# Altium project Tx_rev_B.PrjPcb
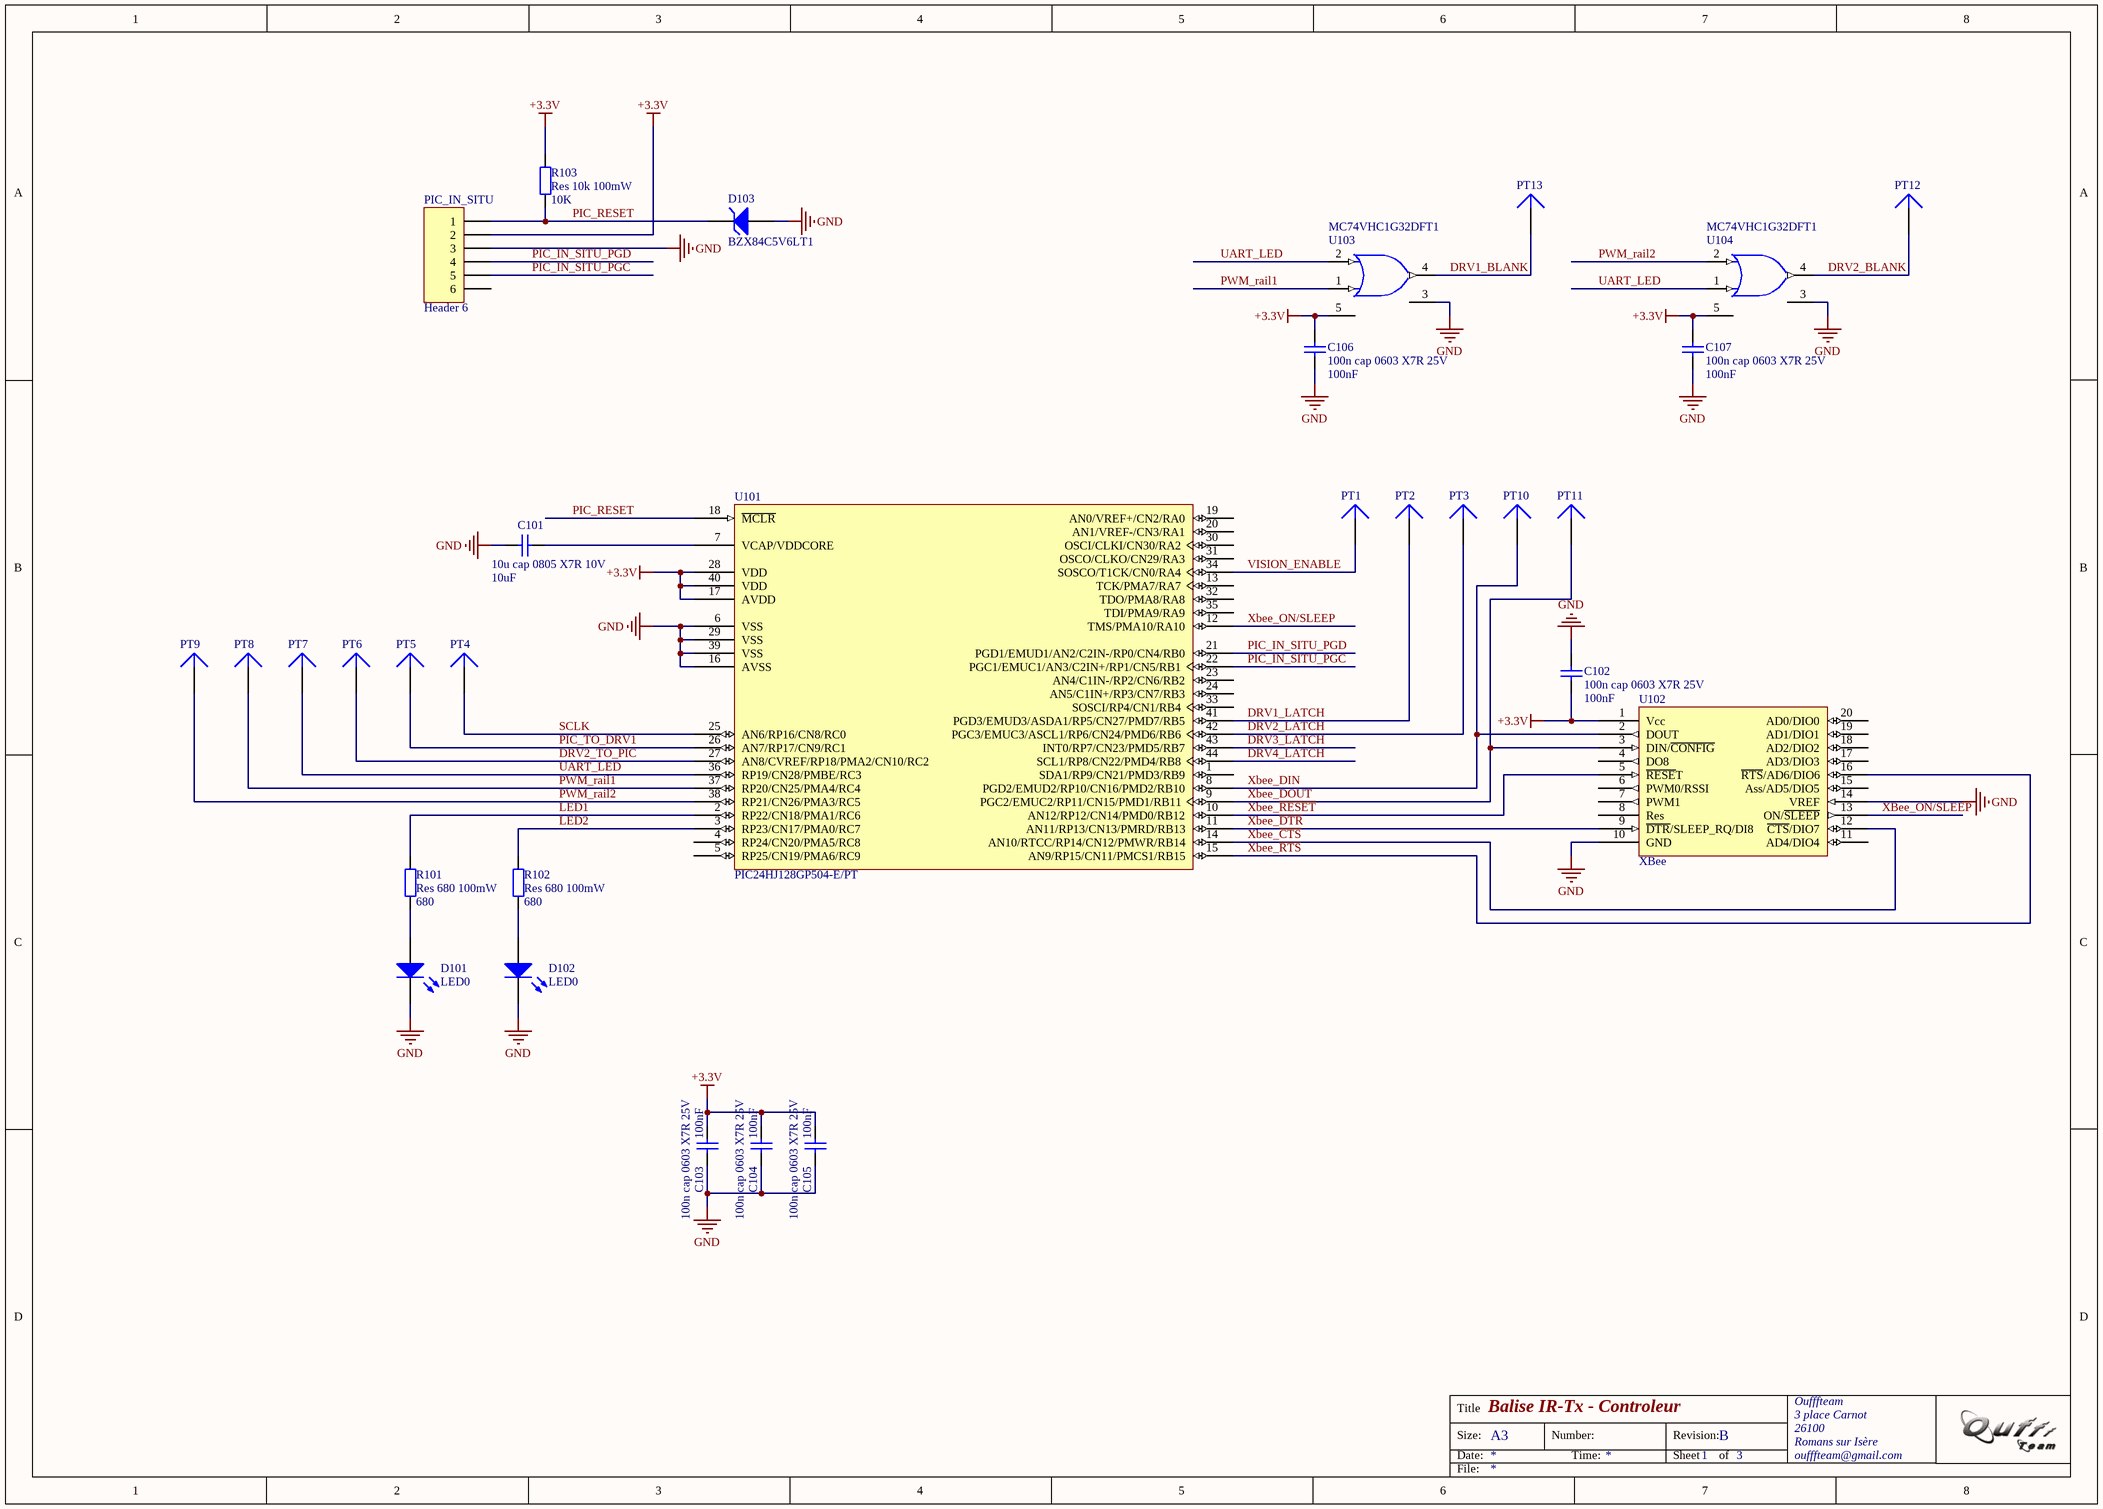
[diagram p0: Tx_micro.SchDoc]
3 sheets, 139 parts. Net scope: global (net labels, ports and power ports of the same name join across sheets).
Board file: Tx_pcb.PcbDoc
Sheets:
  Tx_micro.SchDoc
  Tx_power.SchDoc
  Tx_leds.SchDoc

## Sheet Tx_micro.SchDoc: Balise IR-Tx - Controleur
size A3; Author: B Labbe; CompanyName: Oufffteam; DrawnBy: B Labbe; Engineer: B Labbe; Organization: Oufffteam; Address1: L3, 12a Rodborough Rd; Address2: Frenchs Forest; Address3: NSW; Address4: Australia 2086; Revision: B; SheetNumber: 1; SheetTotal: 3; DocumentName: Balise IR-Tx - Controleur

### Parts
C101  10u cap 0805 X7R 10V  value 10uF  [0805]
C102  100n cap 0603 X7R 25V  value 100nF  [0603]
C103  100n cap 0603 X7R 25V  value 100nF  [0603]
C104  100n cap 0603 X7R 25V  value 100nF  [0603]
C105  100n cap 0603 X7R 25V  value 100nF  [0603]
C106  100n cap 0603 X7R 25V  value 100nF  [0603]
C107  100n cap 0603 X7R 25V  value 100nF  [0603]
D101  LED0  [0603]
D102  LED0  [0603]
D103  BZX84C5V6LT1  [318-07]
PIC_IN_SITU  Header 6  [HDR1X6]
PT1  Plug  [TP]  (value not drawn)
PT2  Plug  [TP]  (value not drawn)
PT3  Plug  [TP]  (value not drawn)
PT4  Plug  [TP]  (value not drawn)
PT5  Plug  [TP]  (value not drawn)
PT6  Plug  [TP]  (value not drawn)
PT7  Plug  [TP]  (value not drawn)
PT8  Plug  [TP]  (value not drawn)
PT9  Plug  [TP]  (value not drawn)
PT10  Plug  [TP]  (value not drawn)
PT11  Plug  [TP]  (value not drawn)
PT12  Plug  [TP]  (value not drawn)
PT13  Plug  [TP]  (value not drawn)
R101  Res 680 100mW  value 680  [0603]
R102  Res 680 100mW  value 680  [0603]
R103  Res 10k 100mW  value 10K  [0603]
U101  PIC24HJ128GP504-E/PT  [TQFP-PT44_L]
U102  XBee  [XBee_SM]
U103  MC74VHC1G32DFT1  [419A-01_L]
U104  MC74VHC1G32DFT1  [419A-01_L]

### Nets
+3.3V: C102.1 C103.2 C104.2 C105.2 C106.2 C107.2 PIC_IN_SITU.2 R103.2 U101.17(AVDD) U101.28(VDD) U101.40(VDD) U102.1(Vcc) U103.5(VDD) U104.5(VDD)  [also labelled VDD]
GND: C101.1 C102.2 C103.1 C104.1 C105.1 C106.1 C107.1 D101.2(K) D102.2(K) D103.1(A) PIC_IN_SITU.3 U101.6(VSS) U101.16(AVSS) U101.29(VSS) U101.39(VSS) U102.10(GND) U102.14(VREF) U103.3(GND) U104.3(GND)
DRV1_BLANK: PT13.1 U103.4(Y)
DRV1_LATCH: PT2.1 U101.41(PGD3/EMUD3/ASDA1/RP5/CN27/PMD7/RB5)
DRV2_BLANK: PT12.1 U104.4(Y)
DRV2_LATCH: PT3.1 U101.42(PGC3/EMUC3/ASCL1/RP6/CN24/PMD6/RB6)
DRV2_TO_PIC: PT6.1 U101.27(AN8/CVREF/RP18/PMA2/CN10/RC2)
DRV3_LATCH: U101.43(INT0/RP7/CN23/PMD5/RB7)
DRV4_LATCH: U101.44(SCL1/RP8/CN22/PMD4/RB8)
LED1: R101.2 U101.2(RP22/CN18/PMA1/RC6)
LED2: R102.2 U101.3(RP23/CN17/PMA0/RC7)
PIC_IN_SITU_PGC: PIC_IN_SITU.5 U101.22(PGC1/EMUC1/AN3/C2IN+/RP1/CN5/RB1)
PIC_IN_SITU_PGD: PIC_IN_SITU.4 U101.21(PGD1/EMUD1/AN2/C2IN-/RP0/CN4/RB0)
PIC_RESET: D103.3(K) PIC_IN_SITU.1 R103.1 U101.18(~{MCLR})
PIC_TO_DRV1: PT5.1 U101.26(AN7/RP17/CN9/RC1)
PWM_rail1: PT8.1 U101.37(RP20/CN25/PMA4/RC4) U103.1(IN_B)
PWM_rail2: PT9.1 U101.38(RP21/CN26/PMA3/RC5) U104.2(IN_A)
SCLK: PT4.1 U101.25(AN6/RP16/CN8/RC0)
UART_LED: PT7.1 U101.36(RP19/CN28/PMBE/RC3) U103.2(IN_A) U104.1(IN_B)
VISION_ENABLE: PT1.1 U101.34(SOSCO/T1CK/CN0/RA4)
Xbee_~{CTS}: U101.14(AN10/RTCC/RP14/CN12/PMWR/RB14) U102.12(~{CTS}/DIO7)
Xbee_~{DTR}: U101.11(AN11/RP13/CN13/PMRD/RB13) U102.9(~{DTR}/SLEEP_RQ/DI8)
Xbee_DIN: PT10.1 U101.8(PGD2/EMUD2/RP10/CN16/PMD2/RB10) U102.2(DOUT)
Xbee_DOUT: PT11.1 U101.9(PGC2/EMUC2/RP11/CN15/PMD1/RB11) U102.3(DIN/~{CONFIG})
XBee_ON/SLEEP: U101.12(TMS/PMA10/RA10) U102.13(ON/~{SLEEP})
Xbee_~{RESET}: U101.10(AN12/RP12/CN14/PMD0/RB12) U102.5(~{RESE}T)
Xbee_~{RTS}: U101.15(AN9/RP15/CN11/PMCS1/RB15) U102.16(~{RTS}/AD6/DIO6)
NetC101_2: C101.2 U101.7(VCAP/VDDCORE)
NetD101_1: D101.1(A) R101.1
NetD102_1: D102.1(A) R102.1

Not connected (* = marked no-connect by the designer): PIC_IN_SITU 6; U101 1(SDA1/RP9/CN21/PMD3/RB9) 4(RP24/CN20/PMA5/RC8) 5(RP25/CN19/PMA6/RC9) 13(TCK/PMA7/RA7) 19(AN0/VREF+/CN2/RA0) 20(AN1/VREF-/CN3/RA1) 23(AN4/C1IN-/RP2/CN6/RB2) 24(AN5/C1IN+/RP3/CN7/RB3) 30(OSCI/CLKI/CN30/RA2) 31(OSCO/CLKO/CN29/RA3) 32(TDO/PMA8/RA8) 33(SOSCI/RP4/CN1/RB4) 35(TDI/PMA9/RA9); U102 4(DO8) 6(PWM0/RSSI) 7(PWM1) 8(Res) 11(AD4/DIO4) 15(Ass/AD5/DIO5) 17(AD3/DIO3) 18(AD2/DIO2) 19(AD1/DIO1) 20(AD0/DIO0)

### Notes on the sheet
- Title
- Size:
- Date:
- A3
- Number:
- Time:
- Revision:
- Sheet
- of
- Oufffteam
- 3 place Carnot
- 26100
- Romans sur Isère
- oufffteam@gmail.com
- File:

### Library data of the parts
C101-C107 = Cap: Capacitor; Published: 8-Jun-2000; LatestRevisionDate: 17-Jul-2002; LatestRevisionNote: Re-released for DXP Platform.; PackageReference: RAD-0.3; Publisher: Altium Limited
D101 D102 = LED0: Typical INFRARED GaAs LED; Published: 8-Jun-2000; LatestRevisionDate: 08-Jul-2005; LatestRevisionNote: Mech Layer 1 removed.; PackageReference: LED-0; Publisher: Altium Limited
D103 = BZX84C5V6LT1: Zener Voltage Regulator Diode; Note: Pin 2 is not connected and not drawn.; Published: 29-Sep-2000; LatestRevisionDate: 17-Jul-2002; LatestRevisionNote: Re-released for DXP Platform.; PackageReference: 318-07; Publisher: Altium Limited; PackageDescription: SOT-23; 3 Leads; Body 3.0 x 2.5 mm, inc. leads (LxW max); ComponentLink1Description: Manufacturer Link; ComponentLink1URL: http://www.onsemi.com/site/products/landing?taxonomyID=194; ComponentLink2Description: Datasheet; ComponentLink2URL: http://www.onsemi.com/pub/Collateral/BZX84C2V4LT1-D.PDF
PIC_IN_SITU = Header 6: Header, 6-Pin; LatestRevisionDate: 17-Jul-2002; LatestRevisionNote: Re-released for DXP Platform.; Publisher: Altium Limited
R101-R103 = Res2: Resistor; Published: 8-Jun-2000; LatestRevisionDate: 17-Jul-2002; LatestRevisionNote: Re-released for DXP Platform.; PackageReference: AXIAL-0.4; Publisher: Altium Limited
U101 = PIC24HJ128GP504-E/PT: High Speed General Purpose 16-Bit Flash Microcontroller, 128KB Flash, 8KB RAM, 44-Pin TQFP, Extended Temperature; Published: 29-Jan-2009; DatasheetVersion: revB, Mar-2008; PackageVersion: revAW, Oct-2008; PackageReference: TQFP-PT44; Publisher: Altium Limited; PackageDescription: 44-Lead Plastic Thin Quad Flatpack (PT) - 10x10x1mm Body, 2.00mm [TQFP]; Code_JEDEC: MS-026; ComponentLink1Description: Manufacturer Link; ComponentLink1URL: http://www.microchip.com; ComponentLink2Description: Datasheet; ComponentLink2URL: http://ww1.microchip.com/downloads/en/DeviceDoc/70293B.pdf; ComponentLink3Description: Packaging Specification; ComponentLink3URL: http://ww1.microchip.com/downloads/en/PackagingSpec/00049AW.pdf
U102 = XBee: OEM RF Modules
U103 U104 = MC74VHC1G32DFT1: 2-Input OR Gate; Published: 15-Apr-2002; LatestRevisionDate: 12-Dec-2006; LatestRevisionNote: IPC-7351 Footprint Added.; DatasheetVersion: Dec-1999; PackageVersion: Oct-1999; PackageReference: 419A-01; Publisher: Altium Limited; PackageDescription: 5-Pin SOT-353 Package 0.65 mm Pitch, 2.1 mm Lead Span; ComponentLink1Description: Manufacturer Link; ComponentLink1URL: http://www.onsemi.com/; ComponentLink2Description: Datasheet; ComponentLink2URL: http://www.onsemi.com/pub/Collateral/MC74VHC1G32.PDF
PT1-PT13 = Plug: LatestRevisionDate: 17-Jul-2002; LatestRevisionNote: Re-released for DXP Platform.; Publisher: Altium Limited

## Sheet Tx_power.SchDoc: Balise IR-Tx - Power
size A3; Author: B Labbe; CompanyName: Oufffteam; DrawnBy: B Labbe; Engineer: B Labbe; Organization: Oufffteam; Address1: L3, 12a Rodborough Rd; Address2: Frenchs Forest; Address3: NSW; Address4: Australia 2086; Revision: B; SheetNumber: 2; SheetTotal: 3; DocumentName: Balise IR-Tx - Power
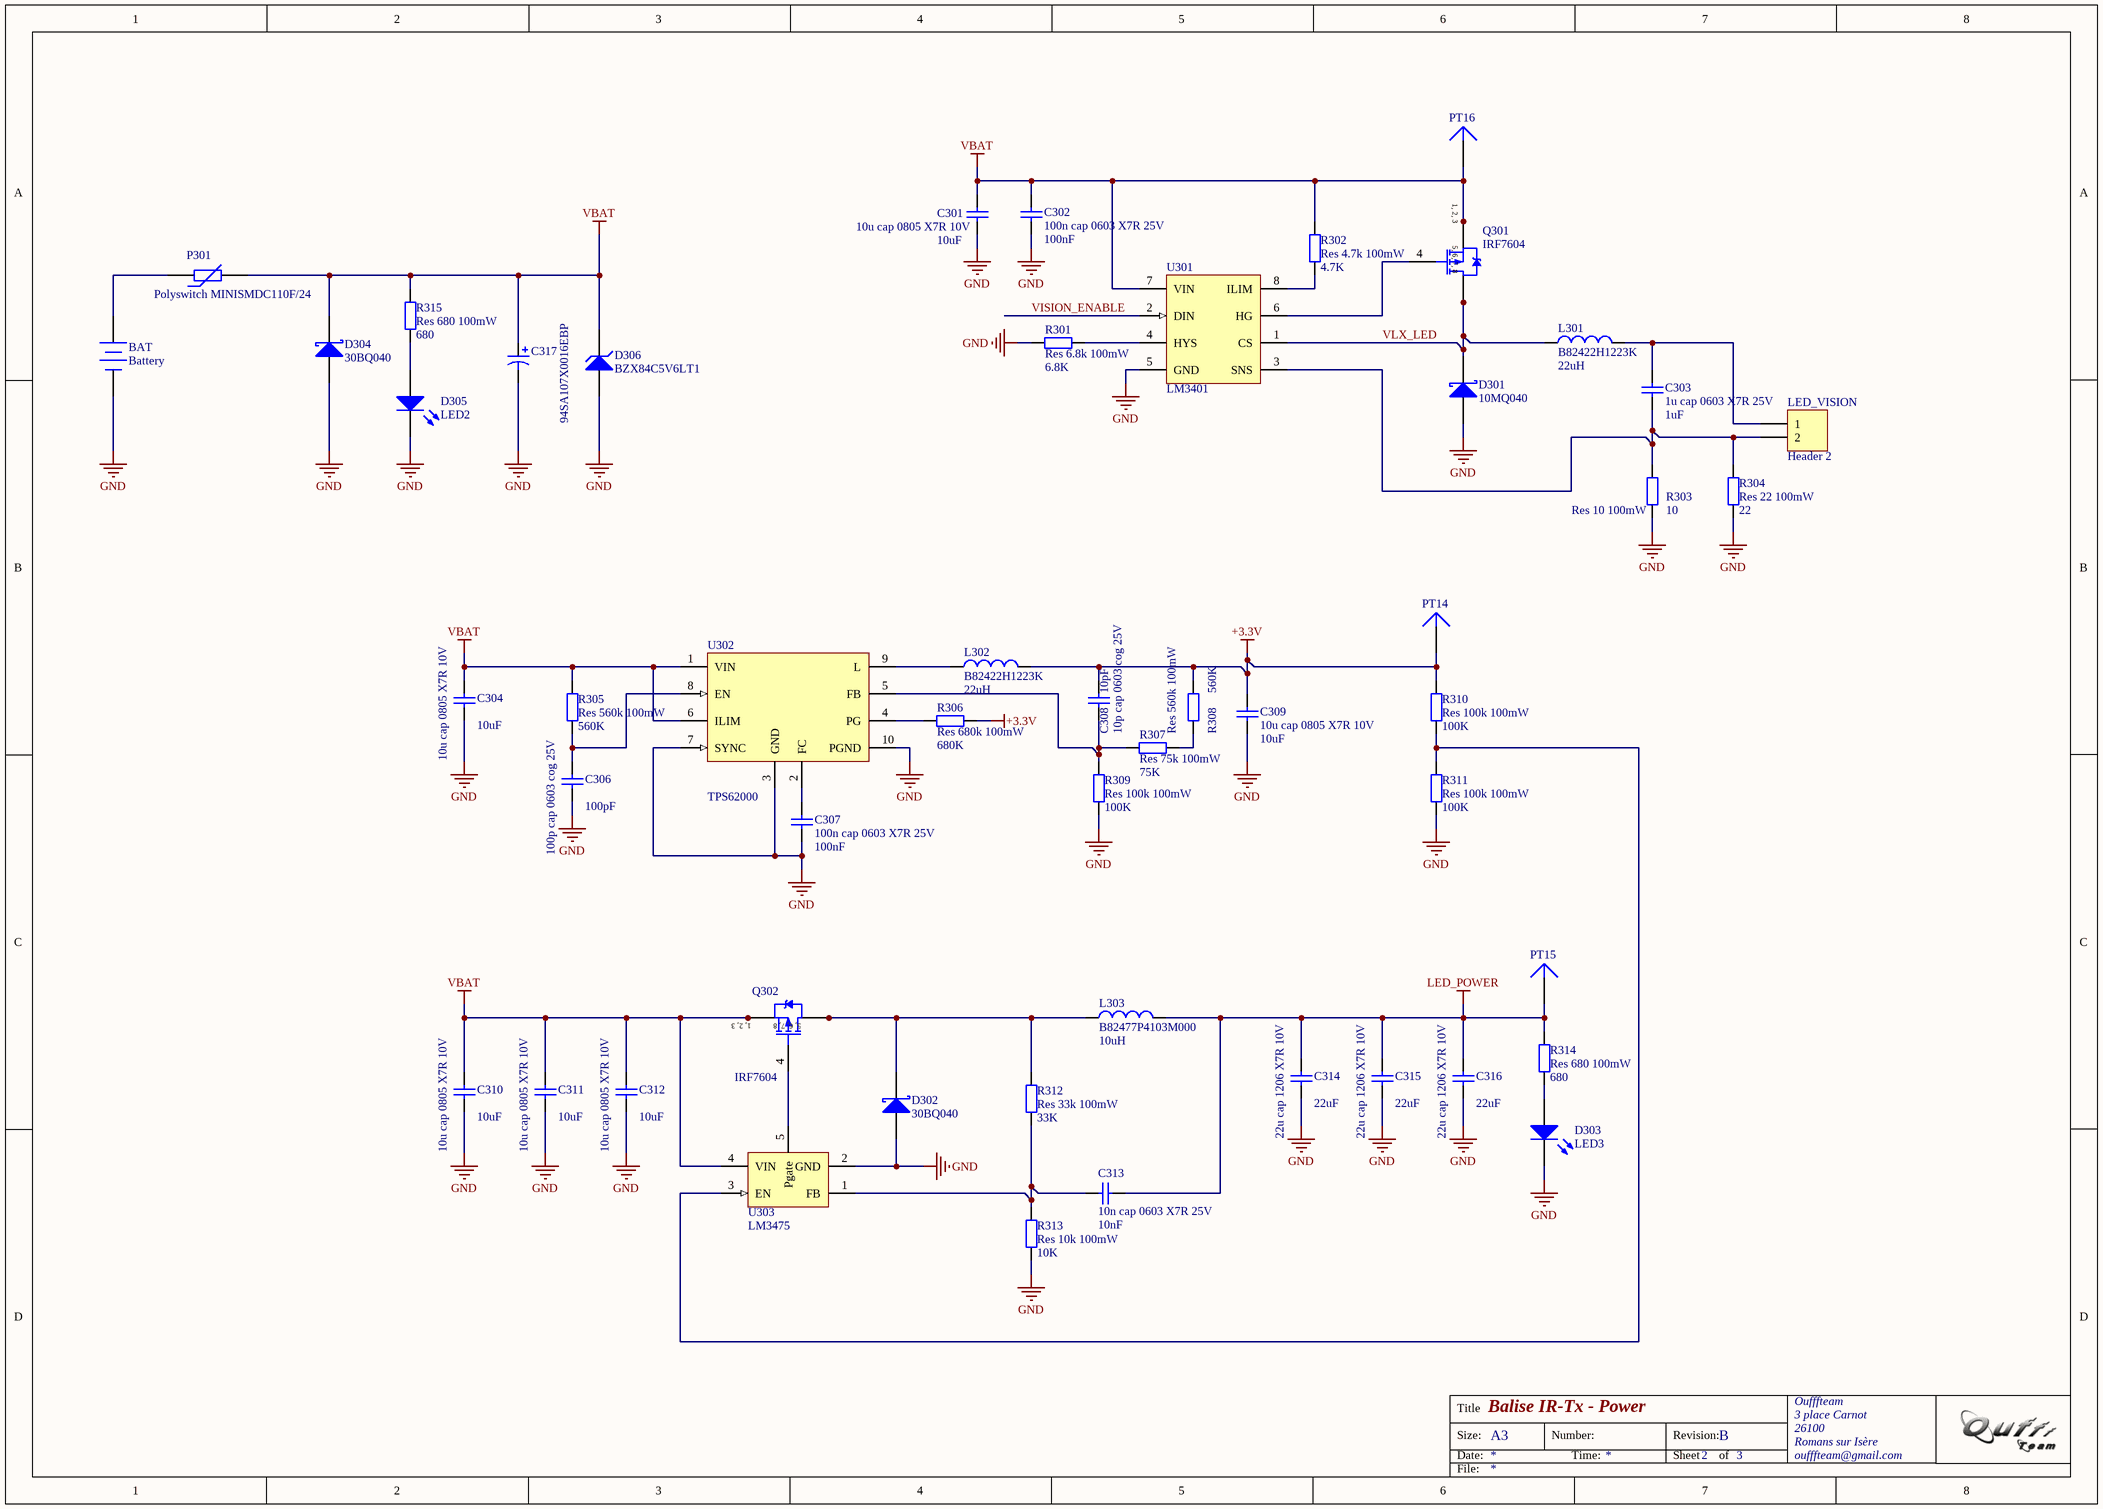
[diagram p1: Tx_power.SchDoc]

### Parts
BAT  Battery  [BAT-2]
C301  10u cap 0805 X7R 10V  value 10uF  [0805]
C302  100n cap 0603 X7R 25V  value 100nF  [0603]
C303  1u cap 0603 X7R 25V  value 1uF  [0603]
C304  10u cap 0805 X7R 10V  value 10uF  [0805]
C306  100p cap 0603 cog 25V  value 100pF  [0603]
C307  100n cap 0603 X7R 25V  value 100nF  [0603]
C308  10p cap 0603 cog 25V  value 10pF  [0603]
C309  10u cap 0805 X7R 10V  value 10uF  [0805]
C310  10u cap 0805 X7R 10V  value 10uF  [0805]
C311  10u cap 0805 X7R 10V  value 10uF  [0805]
C312  10u cap 0805 X7R 10V  value 10uF  [0805]
C313  10n cap 0603 X7R 25V  value 10nF  [0603]
C314  22u cap 1206 X7R 10V  value 22uF  [1206]
C315  22u cap 1206 X7R 10V  value 22uF  [1206]
C316  22u cap 1206 X7R 10V  value 22uF  [1206]
C317  94SA107X0016EBP  [E]
D301  10MQ040  [D-64]
D302  30BQ040  [SMC]
D303  LED3  [0603]
D304  30BQ040  [SMC]
D305  LED2  [0603]
D306  BZX84C5V6LT1  [318-07]
L301  B82422H1223K  value 22uH  [1210]
L302  B82422H1223K  value 22uH  [1210]
L303  B82477P4103M000  value 10uH  [B82477P4103M000]
LED_VISION  Header 2  [HDR1X2]
P301  Polyswitch MINISMDC110F/24  [1812]
PT14  Plug  [TP]  (value not drawn)
PT15  Plug  [TP]  (value not drawn)
PT16  Plug  [TP]  (value not drawn)
Q301  IRF7604  [Micro8]
Q302  IRF7604  [Micro8]
R301  Res 6.8k 100mW  value 6.8K  [0603]
R302  Res 4.7k 100mW  value 4.7K  [0603]
R303  Res 10 100mW  value 10  [0603]
R304  Res 22 100mW  value 22  [0603]
R305  Res 560k 100mW  value 560K  [0603]
R306  Res 680k 100mW  value 680K  [0603]
R307  Res 75k 100mW  value 75K  [0603]
R308  Res 560k 100mW  value 560K  [0603]
R309  Res 100k 100mW  value 100K  [0603]
R310  Res 100k 100mW  value 100K  [0603]
R311  Res 100k 100mW  value 100K  [0603]
R312  Res 33k 100mW  value 33K  [0603]
R313  Res 10k 100mW  value 10K  [0603]
R314  Res 680 100mW  value 680  [0603]
R315  Res 680 100mW  value 680  [0603]
U301  LM3401  [MSOP8]
U302  TPS62000  [MS10]
U303  LM3475  [SOT23-5]

### Nets
+3.3V: C308.2 C309.2 L302.2 PT14.1 R306.2 R308.2 R310.2
GND: BAT.2(-) C301.1 C302.1 C304.1 C306.1 C307.1 C309.1 C310.1 C311.1 C312.1 C314.1 C315.1 C316.1 C317.2 D301.1(A) D302.1(A) D303.2(K) D304.1(A) D305.2(K) D306.1(A) R301.1 R303.1 R304.1 R309.1 R311.1 R313.1 U301.5(GND) U302.3(GND) U302.7(SYNC) U302.10(PGND) U303.2(GND)
LED_POWER: C313.2 C314.2 C315.2 C316.2 L303.2 PT15.1 R314.2
VBAT: C301.2 C302.2 C304.2 C310.2 C311.2 C312.2 C317.1 D304.2(K) D306.3(K) P301.2 PT16.1 Q301.1(S) Q301.2(S) Q301.3(S) Q302.1(S) Q302.2(S) Q302.3(S) R302.2 R305.2 R315.2 U301.7(VIN) U302.1(VIN) U302.6(ILIM) U303.4(VIN)
VISION_ENABLE: U301.2(DIN)
VLX_LED: D301.2(K) L301.1 Q301.5(D) Q301.6(D) Q301.7(D) Q301.8(D) U301.1(CS)
NetBAT_1: BAT.1(+) P301.1
NetC303_1: C303.1 LED_VISION.2 R303.2 R304.2 U301.3(SNS)
NetC303_2: C303.2 L301.2 LED_VISION.1
NetC306_2: C306.2 R305.1 U302.8(EN)
NetC307_2: C307.2 U302.2(FC)
NetC308_1: C308.1 R307.1 R309.2 U302.5(FB)
NetC313_1: C313.1 R312.1 R313.2 U303.1(FB)
NetD302_2: D302.2(K) L303.1 Q302.5(D) Q302.6(D) Q302.7(D) Q302.8(D) R312.2
NetD303_1: D303.1(A) R314.1
NetD305_1: D305.1(A) R315.1
NetL302_1: L302.1 U302.9(L)
NetQ301_4: Q301.4(G) U301.6(HG)
NetQ302_4: Q302.4(G) U303.5(Pgate)
NetR301_2: R301.2 U301.4(HYS)
NetR302_1: R302.1 U301.8(ILIM)
NetR306_1: R306.1 U302.4(PG)
NetR307_2: R307.2 R308.1
NetR310_1: R310.1 R311.2 U303.3(EN)

### Notes on the sheet
- Title
- Size:
- Date:
- A3
- Number:
- Time:
- Revision:
- Sheet
- of
- Oufffteam
- 3 place Carnot
- 26100
- Romans sur Isère
- oufffteam@gmail.com
- File:
- (in symbol IRF7604) 1, 2, 3; 5, 6, 7, 8

### Library data of the parts
BAT = Battery: Multicell Battery; Published: 24-Mar-1999; LatestRevisionDate: 17-Jul-2002; LatestRevisionNote: Re-released for DXP Platform.; PackageReference: BAT-2; Publisher: Altium Limited
C301-C304 C306-C316 = Cap: Capacitor; Published: 8-Jun-2000; LatestRevisionDate: 17-Jul-2002; LatestRevisionNote: Re-released for DXP Platform.; PackageReference: RAD-0.3; Publisher: Altium Limited
C317 = 94SA107X0016EBP: Solid Aluminum Capacitor with Organic Semiconductor Electrolyte: 100uF, 16V, Bulk Pack; Note: Part Numbers shown are for ± 20% capacitance tolerance (X0).; PCB_Layout: Complies with Manufacturer's Recommendation.; DrillSize: Nominal, Rounded to the nearest 0.1mm; Published: 19-Mar-2004; DatasheetDocument: 29-Jun-2001; PackageReference: E; Publisher: Altium Limited; ComponentLink1Description: Manufacturer Link; ComponentLink1URL: http://www.vishay.com/; ComponentLink2Description: Datasheet; ComponentLink2URL: http://www.vishay.com/docs/90003/94sa.pdf; Value: 100uF
D301 = 10MQ040: Schottky Rectifier; Published: 8-Jun-2000; LatestRevisionDate: 17-Jul-2002; LatestRevisionNote: Re-released for DXP Platform.; DatasheetDocument: Dec-1997; PackageReference: D-64; Publisher: Altium Limited; ComponentLink1Description: Manufacturer Link; ComponentLink1URL: http://www.irf.com/; ComponentLink2Description: Datasheet; ComponentLink2URL: http://www.irf.com/product-info/datasheets/data/10mq040n.pdf
D302 D304 = 30BQ040: Schottky Rectifier; Published: 8-Jun-2000; LatestRevisionDate: 17-Jul-2002; LatestRevisionNote: Re-released for DXP Platform.; DatasheetDocument: PD-2.439; PackageReference: SMC; Publisher: Altium Limited; Code_JEDEC: DO-214-AB; ComponentLink1Description: Manufacturer Link; ComponentLink1URL: http://www.irf.com/; ComponentLink2Description: Datasheet; ComponentLink2URL: http://www.irf.com/product-info/datasheets/data/30bq040.pdf
D303 = LED3: Typical BLUE SiC LED; Published: 8-Jun-2000; LatestRevisionDate: 17-Dec-2003; LatestRevisionNote: PCB Footprint replaced.; DatasheetDocument: 16-Apr-2002; PackageDocument: 16-Apr-2002; PackageReference: 3.5X2.8X1.9; Publisher: Altium Limited
D305 = LED2: Typical RED, GREEN, YELLOW, AMBER GaAs LED; Published: 8-Jun-2000; LatestRevisionDate: 17-Jul-2002; LatestRevisionNote: Re-released for DXP Platform.; PackageDocument: Feb-2002; PackageReference: 3.2X1.6X1.1; Publisher: Altium Limited
D306 = BZX84C5V6LT1: as D103 on sheet Tx_micro; Published: 29-Sep-2000; LatestRevisionDate: 17-Jul-2002; LatestRevisionNote: Re-released for DXP Platform.; PackageReference: 318-07; Publisher: Altium Limited; PackageDescription: SOT-23; 3 Leads; Body 3.0 x 2.5 mm, inc. leads (LxW max); ComponentLink1Description: Manufacturer Link; ComponentLink1URL: http://www.onsemi.com/site/products/landing?taxonomyID=194; ComponentLink2Description: Datasheet; ComponentLink2URL: http://www.onsemi.com/pub/Collateral/BZX84C2V4LT1-D.PDF
L301-L303 = Inductor: Code_IEC: 1005; Published: 8-Jun-2000; LatestRevisionDate: 17-Jul-2002; LatestRevisionNote: Re-released for DXP Platform.; PackageReference: 0402-A; Publisher: Altium Limited; Code_JEITA: 0402
LED_VISION = Header 2: Header, 2-Pin; LatestRevisionDate: 17-Jul-2002; LatestRevisionNote: Re-released for DXP Platform.; Publisher: Altium Limited
P301 = Res Varistor: Varistor (Voltage-Sensitive Resistor); Published: 24-Mar-1999; LatestRevisionDate: 04-Mar-2005; LatestRevisionNote: PCB Footprint replaced.; PackageReference: 6-0805; Publisher: Altium Limited
Q301 Q302 = IRF7604: HEXFET Power MOSFET; Published: 8-Jun-2000; LatestRevisionDate: 04-Mar-2005; LatestRevisionNote: Stylized 3D Model Added.; DatasheetVersion: Dec-1997; PackageReference: Micro8; Publisher: Altium Limited; PackageDescription: Shrink Small Outline; 8 Leads; Body Width 3 mm; Pitch 0.65 mm; ComponentLink1Description: Manufacturer Link; ComponentLink1URL: http://www.irf.com/; ComponentLink2Description: Datasheet; ComponentLink2URL: http://www.irf.com/product-info/datasheets/data/irf7604.pdf
R301-R315 = Res2: Resistor; Published: 8-Jun-2000; LatestRevisionDate: 17-Jul-2002; LatestRevisionNote: Re-released for DXP Platform.; PackageReference: AXIAL-0.4; Publisher: Altium Limited
U301 = LM3401: Hysteretic PFET Controller for High Power LED Drive
U302 = TPS6200x: HIGH-EFFICIENCY STEP-DOWN LOW POWER DC-DC CONVERTER
U303 = LM3475: Hysteretic PFET Buck Controller
PT14-PT16 = Plug: LatestRevisionDate: 17-Jul-2002; LatestRevisionNote: Re-released for DXP Platform.; Publisher: Altium Limited

## Sheet Tx_leds.SchDoc: Balise IR-Tx - LEDs
size A3; Author: B Labbe; CompanyName: Oufffteam; DrawnBy: B Labbe; Engineer: B Labbe; Organization: Oufffteam; Address1: L3, 12a Rodborough Rd; Address2: Frenchs Forest; Address3: NSW; Address4: Australia 2086; Revision: B; SheetNumber: 3; SheetTotal: 3; DocumentName: Balise IR-Tx - LEDs
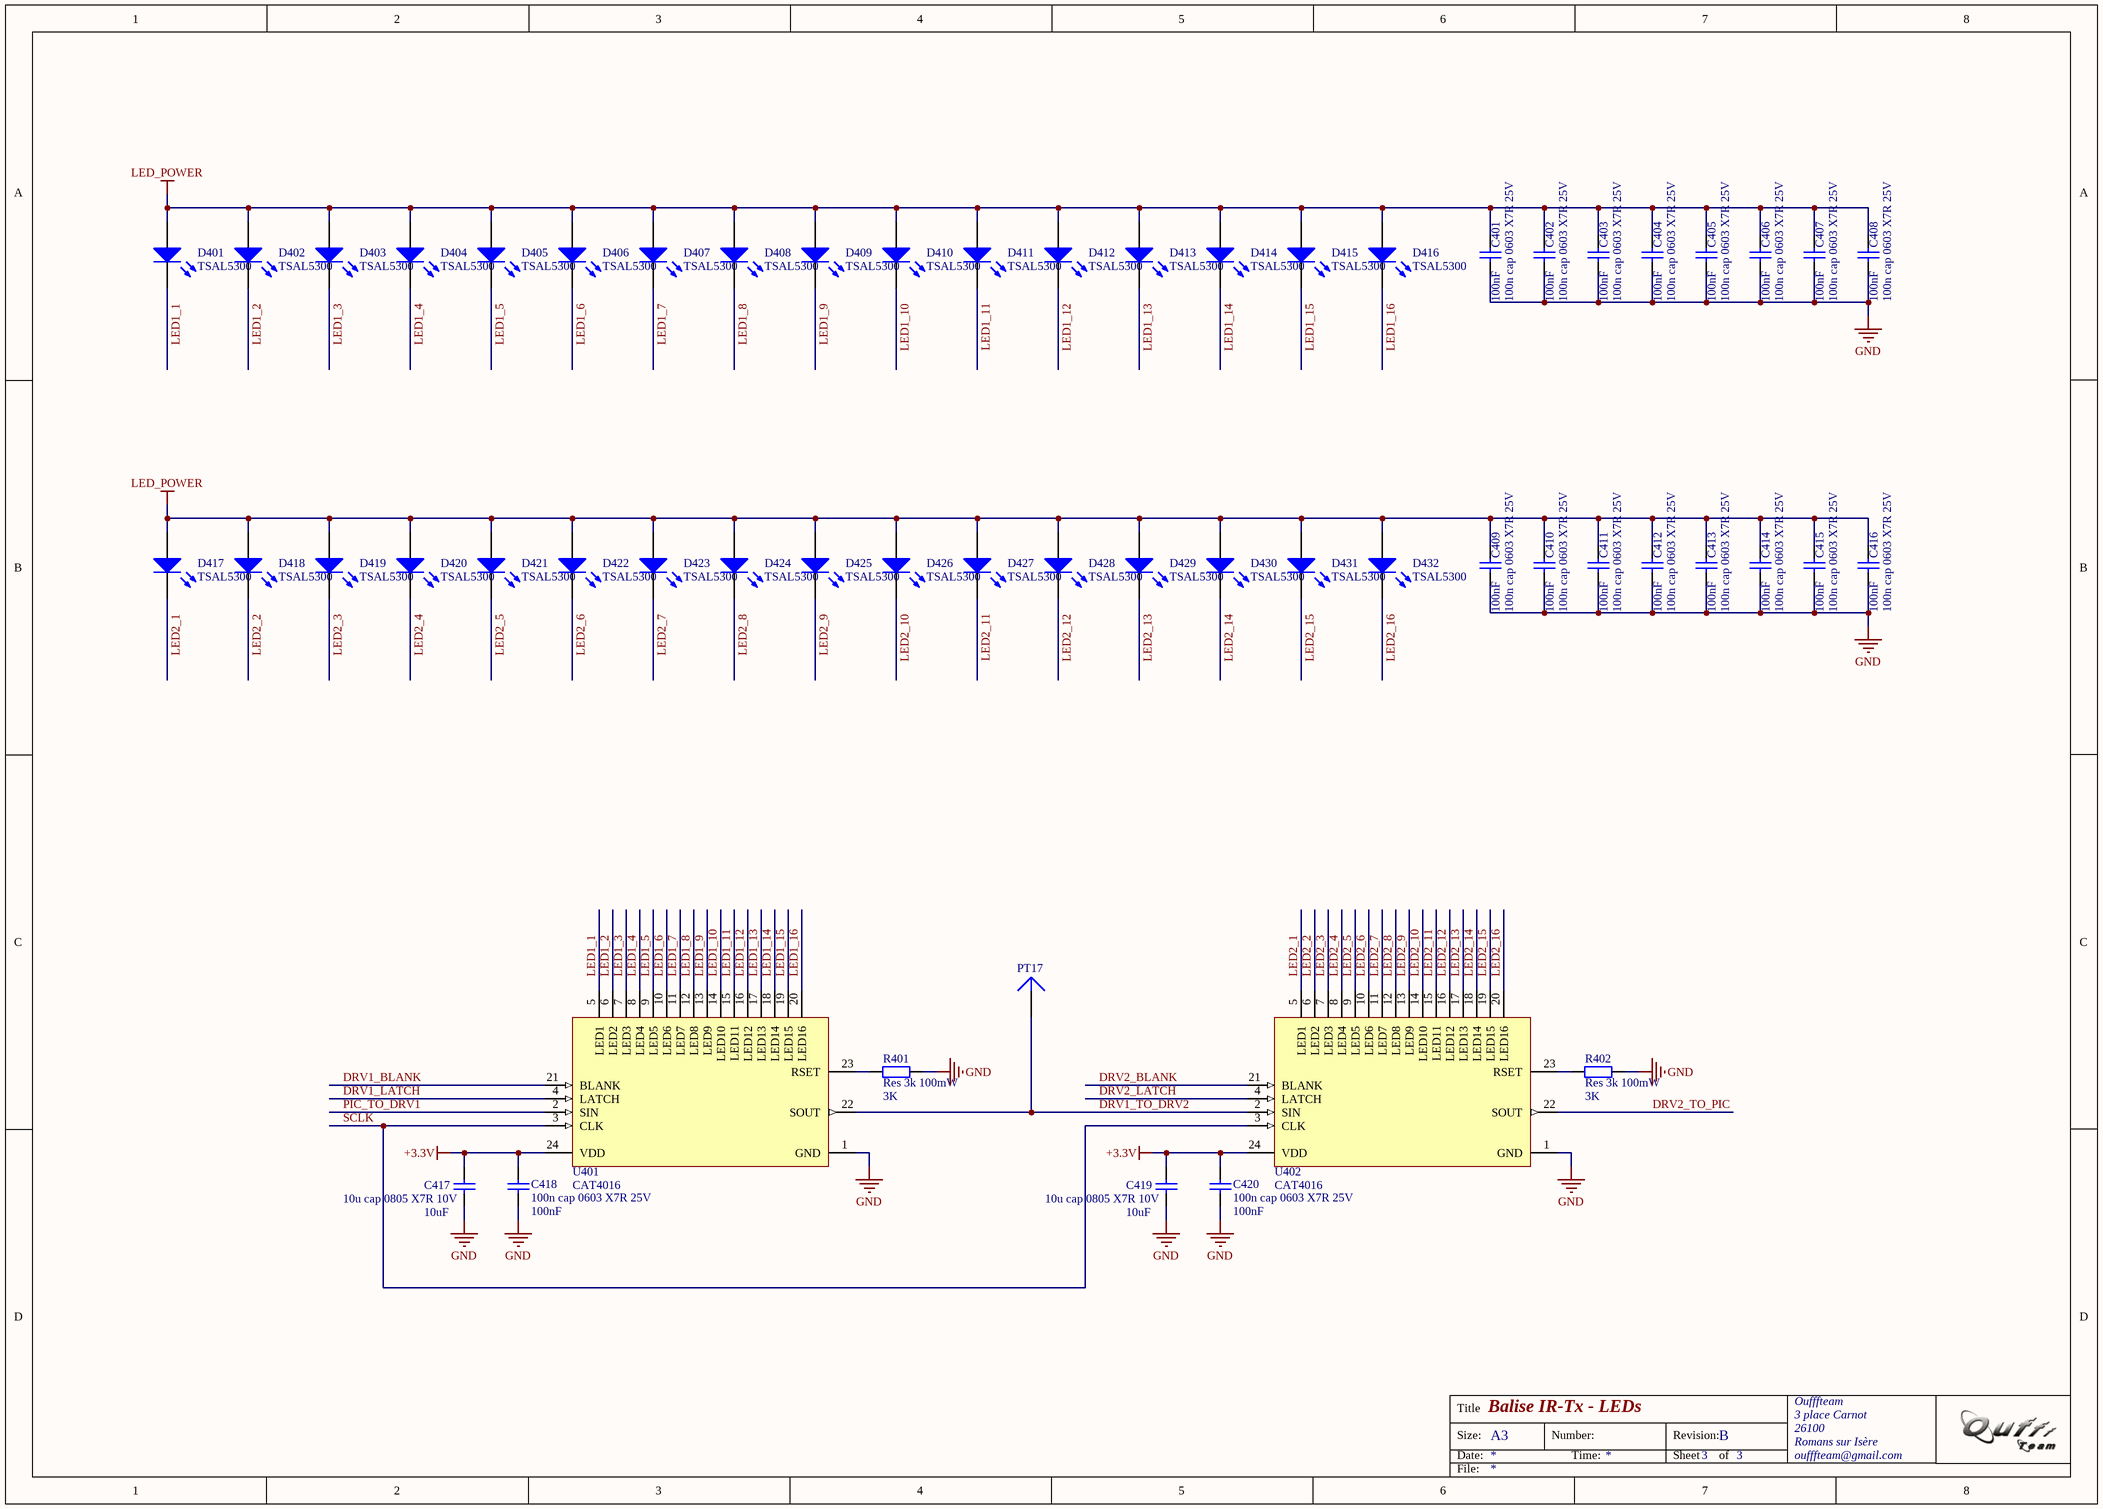
[diagram p2: Tx_leds.SchDoc]

### Parts
C401  100n cap 0603 X7R 25V  value 100nF  [0603]
C402  100n cap 0603 X7R 25V  value 100nF  [0603]
C403  100n cap 0603 X7R 25V  value 100nF  [0603]
C404  100n cap 0603 X7R 25V  value 100nF  [0603]
C405  100n cap 0603 X7R 25V  value 100nF  [0603]
C406  100n cap 0603 X7R 25V  value 100nF  [0603]
C407  100n cap 0603 X7R 25V  value 100nF  [0603]
C408  100n cap 0603 X7R 25V  value 100nF  [0603]
C409  100n cap 0603 X7R 25V  value 100nF  [0603]
C410  100n cap 0603 X7R 25V  value 100nF  [0603]
C411  100n cap 0603 X7R 25V  value 100nF  [0603]
C412  100n cap 0603 X7R 25V  value 100nF  [0603]
C413  100n cap 0603 X7R 25V  value 100nF  [0603]
C414  100n cap 0603 X7R 25V  value 100nF  [0603]
C415  100n cap 0603 X7R 25V  value 100nF  [0603]
C416  100n cap 0603 X7R 25V  value 100nF  [0603]
C417  10u cap 0805 X7R 10V  value 10uF  [0805]
C418  100n cap 0603 X7R 25V  value 100nF  [0603]
C419  10u cap 0805 X7R 10V  value 10uF  [0805]
C420  100n cap 0603 X7R 25V  value 100nF  [0603]
D401  TSAL5300  [LED-1]
D402  TSAL5300  [LED-1]
D403  TSAL5300  [LED-1]
D404  TSAL5300  [LED-1]
D405  TSAL5300  [LED-1]
D406  TSAL5300  [LED-1]
D407  TSAL5300  [LED-1]
D408  TSAL5300  [LED-1]
D409  TSAL5300  [LED-1]
D410  TSAL5300  [LED-1]
D411  TSAL5300  [LED-1]
D412  TSAL5300  [LED-1]
D413  TSAL5300  [LED-1]
D414  TSAL5300  [LED-1]
D415  TSAL5300  [LED-1]
D416  TSAL5300  [LED-1]
D417  TSAL5300  [LED-1]
D418  TSAL5300  [LED-1]
D419  TSAL5300  [LED-1]
D420  TSAL5300  [LED-1]
D421  TSAL5300  [LED-1]
D422  TSAL5300  [LED-1]
D423  TSAL5300  [LED-1]
D424  TSAL5300  [LED-1]
D425  TSAL5300  [LED-1]
D426  TSAL5300  [LED-1]
D427  TSAL5300  [LED-1]
D428  TSAL5300  [LED-1]
D429  TSAL5300  [LED-1]
D430  TSAL5300  [LED-1]
D431  TSAL5300  [LED-1]
D432  TSAL5300  [LED-1]
PT17  Plug  [TP]  (value not drawn)
R401  Res 3k 100mW  value 3K  [0603]
R402  Res 3k 100mW  value 3K  [0603]
U401  CAT4016  [TSSOP65P640X120-24L]
U402  CAT4016  [TSSOP65P640X120-24L]

### Nets
+3.3V: C417.2 C418.2 C419.2 C420.2 U401.24(VDD) U402.24(VDD)
GND: C401.1 C402.1 C403.1 C404.1 C405.1 C406.1 C407.1 C408.1 C409.1 C410.1 C411.1 C412.1 C413.1 C414.1 C415.1 C416.1 C417.1 C418.1 C419.1 C420.1 R401.2 R402.2 U401.1(GND) U402.1(GND)
LED_POWER: C401.2 C402.2 C403.2 C404.2 C405.2 C406.2 C407.2 C408.2 C409.2 C410.2 C411.2 C412.2 C413.2 C414.2 C415.2 C416.2 D401.1(A) D402.1(A) D403.1(A) D404.1(A) D405.1(A) D406.1(A) D407.1(A) D408.1(A) D409.1(A) D410.1(A) D411.1(A) D412.1(A) D413.1(A) D414.1(A) D415.1(A) D416.1(A) D417.1(A) D418.1(A) D419.1(A) D420.1(A) D421.1(A) D422.1(A) D423.1(A) D424.1(A) D425.1(A) D426.1(A) D427.1(A) D428.1(A) D429.1(A) D430.1(A) D431.1(A) D432.1(A)
DRV1_BLANK: U401.21(BLANK)
DRV1_LATCH: U401.4(LATCH)
DRV1_TO_DRV2: PT17.1 U401.22(SOUT) U402.2(SIN)
DRV2_BLANK: U402.21(BLANK)
DRV2_LATCH: U402.4(LATCH)
DRV2_TO_PIC: U402.22(SOUT)
LED1_1: D401.2(K) U401.5(LED1)
LED1_2: D402.2(K) U401.6(LED2)
LED1_3: D403.2(K) U401.7(LED3)
LED1_4: D404.2(K) U401.8(LED4)
LED1_5: D405.2(K) U401.9(LED5)
LED1_6: D406.2(K) U401.10(LED6)
LED1_7: D407.2(K) U401.11(LED7)
LED1_8: D408.2(K) U401.12(LED8)
LED1_9: D409.2(K) U401.13(LED9)
LED1_10: D410.2(K) U401.14(LED10)
LED1_11: D411.2(K) U401.15(LED11)
LED1_12: D412.2(K) U401.16(LED12)
LED1_13: D413.2(K) U401.17(LED13)
LED1_14: D414.2(K) U401.18(LED14)
LED1_15: D415.2(K) U401.19(LED15)
LED1_16: D416.2(K) U401.20(LED16)
LED2_1: D417.2(K) U402.5(LED1)
LED2_2: D418.2(K) U402.6(LED2)
LED2_3: D419.2(K) U402.7(LED3)
LED2_4: D420.2(K) U402.8(LED4)
LED2_5: D421.2(K) U402.9(LED5)
LED2_6: D422.2(K) U402.10(LED6)
LED2_7: D423.2(K) U402.11(LED7)
LED2_8: D424.2(K) U402.12(LED8)
LED2_9: D425.2(K) U402.13(LED9)
LED2_10: D426.2(K) U402.14(LED10)
LED2_11: D427.2(K) U402.15(LED11)
LED2_12: D428.2(K) U402.16(LED12)
LED2_13: D429.2(K) U402.17(LED13)
LED2_14: D430.2(K) U402.18(LED14)
LED2_15: D431.2(K) U402.19(LED15)
LED2_16: D432.2(K) U402.20(LED16)
PIC_TO_DRV1: U401.2(SIN)
SCLK: U401.3(CLK) U402.3(CLK)
NetR401_1: R401.1 U401.23(RSET)
NetR402_1: R402.1 U402.23(RSET)

### Notes on the sheet
- Title
- Size:
- Date:
- A3
- Number:
- Time:
- Revision:
- Sheet
- of
- Oufffteam
- 3 place Carnot
- 26100
- Romans sur Isère
- oufffteam@gmail.com
- File:

### Library data of the parts
C401-C420 = Cap: Capacitor; Published: 8-Jun-2000; LatestRevisionDate: 17-Jul-2002; LatestRevisionNote: Re-released for DXP Platform.; PackageReference: RAD-0.3; Publisher: Altium Limited
D401-D432 = LED1: Typical RED GaAs LED; Published: 8-Jun-2000; LatestRevisionDate: 08-Jul-2005; LatestRevisionNote: Mech Layer 1 removed.; PackageReference: LED-1; Publisher: Altium Limited
R401 R402 = Res2: Resistor; Published: 8-Jun-2000; LatestRevisionDate: 17-Jul-2002; LatestRevisionNote: Re-released for DXP Platform.; PackageReference: AXIAL-0.4; Publisher: Altium Limited
U401 U402 = CAT4016: 16-Channel Constant Current LED Driver
PT17 = Plug: LatestRevisionDate: 17-Jul-2002; LatestRevisionNote: Re-released for DXP Platform.; Publisher: Altium Limited

## Nets that join several sheets
+3.3V: Tx_micro (14 pins), Tx_power (7 pins), Tx_leds (6 pins)
GND: Tx_micro (19 pins), Tx_power (31 pins), Tx_leds (24 pins)
LED_POWER: Tx_power (7 pins), Tx_leds (48 pins)
DRV1_BLANK: Tx_micro (PT13.1 U103.4), Tx_leds (U401.21)
DRV1_LATCH: Tx_micro (PT2.1 U101.41), Tx_leds (U401.4)
DRV2_BLANK: Tx_micro (PT12.1 U104.4), Tx_leds (U402.21)
DRV2_LATCH: Tx_micro (PT3.1 U101.42), Tx_leds (U402.4)
DRV2_TO_PIC: Tx_micro (PT6.1 U101.27), Tx_leds (U402.22)
PIC_TO_DRV1: Tx_micro (PT5.1 U101.26), Tx_leds (U401.2)
SCLK: Tx_micro (PT4.1 U101.25), Tx_leds (U401.3 U402.3)
VISION_ENABLE: Tx_micro (PT1.1 U101.34), Tx_power (U301.2)